# Altium schematic sheet SSL-2020-MCUBoard2.SchDoc
size A4
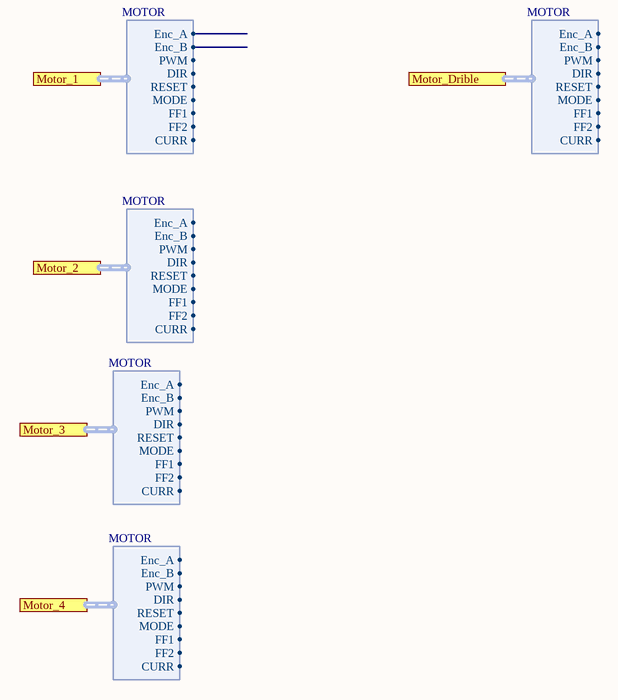
[diagram p0: SSL-2020-MCUBoard2.SchDoc]

## Ports
Motor_1 (harness MOTOR), Motor_2 (harness MOTOR), Motor_3 (harness MOTOR), Motor_4 (harness MOTOR), Motor_Drible (harness MOTOR)

## Harnesses
MOTOR: Enc_A, Enc_B, PWM, DIR, RESET, MODE, FF1, FF2, CURR